# EAGLE design tvout (EAGLE 6.2)
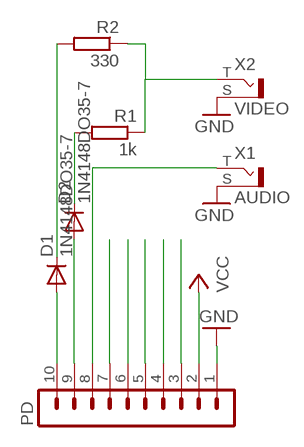
[diagram p0: schematic, sheet 1]

## Parts
D1  1N4148DO35-7  [DO35-7]
D2  1N4148DO35-7  [DO35-7]
PD  MA10-1W  [MA10-1W]
R1  1k  R-EU_0207/10  [0207/10]
R2  330  R-EU_0207/12  [0207/12]
X1  AUDIO  WBTOR1  [WBTOR1]
X2  VIDEO  WBTOR1  [WBTOR1]

## Nets
N$1: PD.5
N$2: D1.C R2.2
N$3: PD.3
N$4: D1.A PD.10
N$5: D2.A PD.9
N$6: D2.C R1.2
N$7: R1.1 R2.1 X2.T
N$10: PD.1 X1.S X2.S ; supply symbol labelled GND
N$12: PD.7
N$14: PD.6
N$15: PD.8 X1.T
N$16: PD.4
VCC: PD.2

## Library data of the parts
D1 D2 = diode:1N4148: DIODE high speed (Philips)
PD = con-lstb:MA10-1W: PIN HEADER
R1 R2 = rcl:R-EU_: RESISTOR, European symbol
X1 X2 = con-lumberg:WBTOR1: RCA connectors according to JEITA RC-5231 Cinch RCA-Einbaukupplung nach JEITA RC-5231, abgewinkelte Ausführung Source: http://www.lumberg.de/Produkte/PDFs/WBTOR1.pdf; MPN: WBTOR 1 BLACK; OC_FARNELL: 1200146; OC_NEWARK: 98K2588

## Board
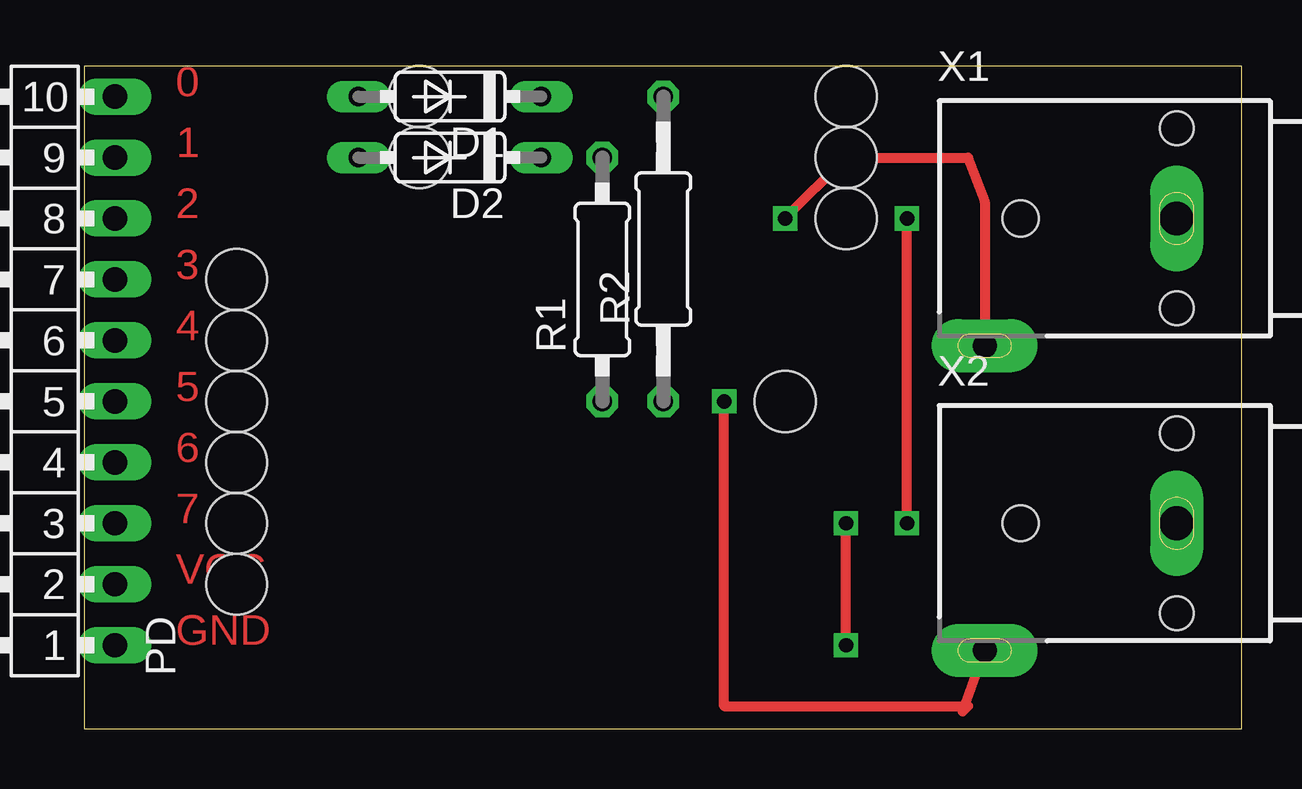
[diagram p1: board, top side]
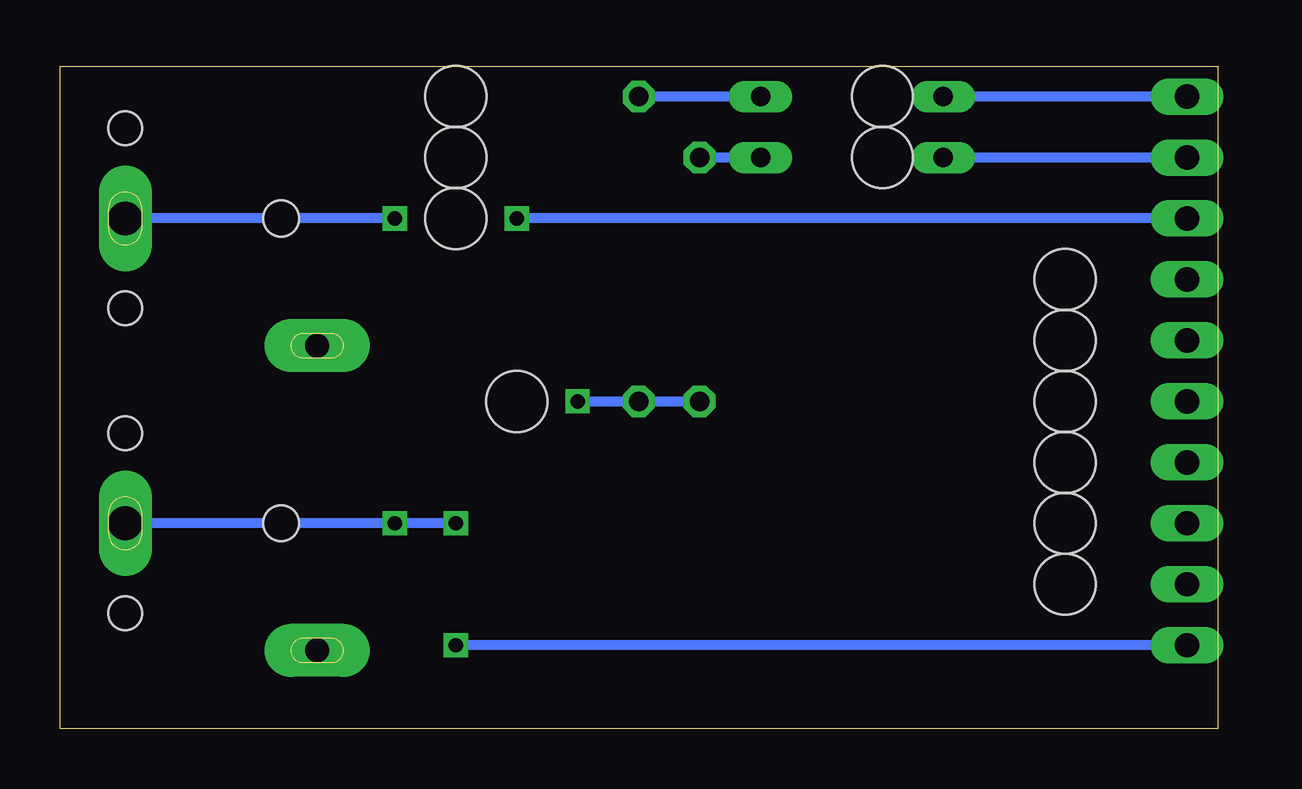
[diagram p2: board, bottom side, seen from below]

Size 48.25 x 27.61 mm. Coordinates in mm from the lower left corner, seen from the top.
Outline: 0,27.61 0,0 48.25,0 48.25,27.61 0,27.61
Copper layers (1*16): Top 0.035mm / dielectric 1.5mm / Bottom 0.035mm
Design rules: minimum track width 10mil, minimum drill 24mil, track to track 8mil, track to pad 8mil, pad to pad 8mil, via to via 8mil, smd to smd 8mil, copper to edge 40mil, drill to drill 8mil, minimum pad ring 10mil, minimum via ring 8mil, stop-mask expansion 4mil, vias tented up to drill 0mil, thermal gap 10mil
Holes 2.54 mm at 6.35,18.72 6.35,16.18 6.35,13.64 6.35,11.1 6.35,8.56 29.21,13.64 31.75,21.26 13.97,26.34 13.97,23.8 6.35,6.02 31.75,23.8 31.75,26.34

### Footprints (pad centres in the part's own frame; a part is rotated, then mirrored left to right if it is on the bottom)
DO35-7 = drill 0.813 long: A 3.81,0; C -3.81,0
MA10-1W = drill 1.016 long: 1 -11.43,0; 2 -8.89,0; 3 -6.35,0; 4 -3.81,0; 5 -1.27,0; 6 1.27,0; 7 3.81,0; 8 6.35,0; 9 8.89,0; 10 11.43,0
0207/10 = drill 0.813 octagon: 1 -5.08,0; 2 5.08,0
0207/12 = drill 0.813 octagon: 1 -6.35,0; 2 6.35,0
WBTOR1 = drill 1.4 pad 2.2 long: S 0,-4 | drill 1 pad 2.2 long: T 5.3,-12 | hole 1.4: -3.75,-4; 3.75,-4 | hole 1.5: 0,-10.5

### Placement (x,y rotation side)
D1  15.24,26.34 180 top
D2  15.24,23.8 180 top
PD  1.27,14.91 90 top
R1  21.59,18.72 90 top
R2  24.13,19.99 90 top
X1  49.53,21.26 270 top
X2  49.53,8.56 270 top

### Tracks (layer width: path | path; a pad name or v marks a point on that pad's centre or on a via)
N$2
  Bottom 0.406: D1.C R2.2
N$4
  Bottom 0.406: PD.10 D1.A
N$5
  Bottom 0.406: PD.9 D2.A
N$6
  Bottom 0.406: D2.C R1.2
N$7  (via drill 0.6)
  Top 0.406: X2.T 36.61,0.72 36.83,0.94 26.67,0.94 v26.67,13.64
  Bottom 0.406: R1.1 R2.1 v26.67,13.64
N$10  (via drill 0.6)
  Top 0.406: v34.29,8.56 v34.29,21.26 | v31.75,3.48 v31.75,8.56
  Bottom 0.406: PD.1 v31.75,3.48 | v34.29,21.26 X1.S | X2.S v34.29,8.56 v31.75,8.56
N$15  (via drill 0.6)
  Top 0.406: v29.21,21.26 31.75,23.8 36.83,23.8 37.53,21.96 X1.T
  Bottom 0.406: PD.8 v29.21,21.26

### Text on the board
Top: 0 | 1 | 2 | 3 | 4 | 5 | 6 | 7 | VCC | GND